# Altium project PCB_NRF24L01.PrjPcb
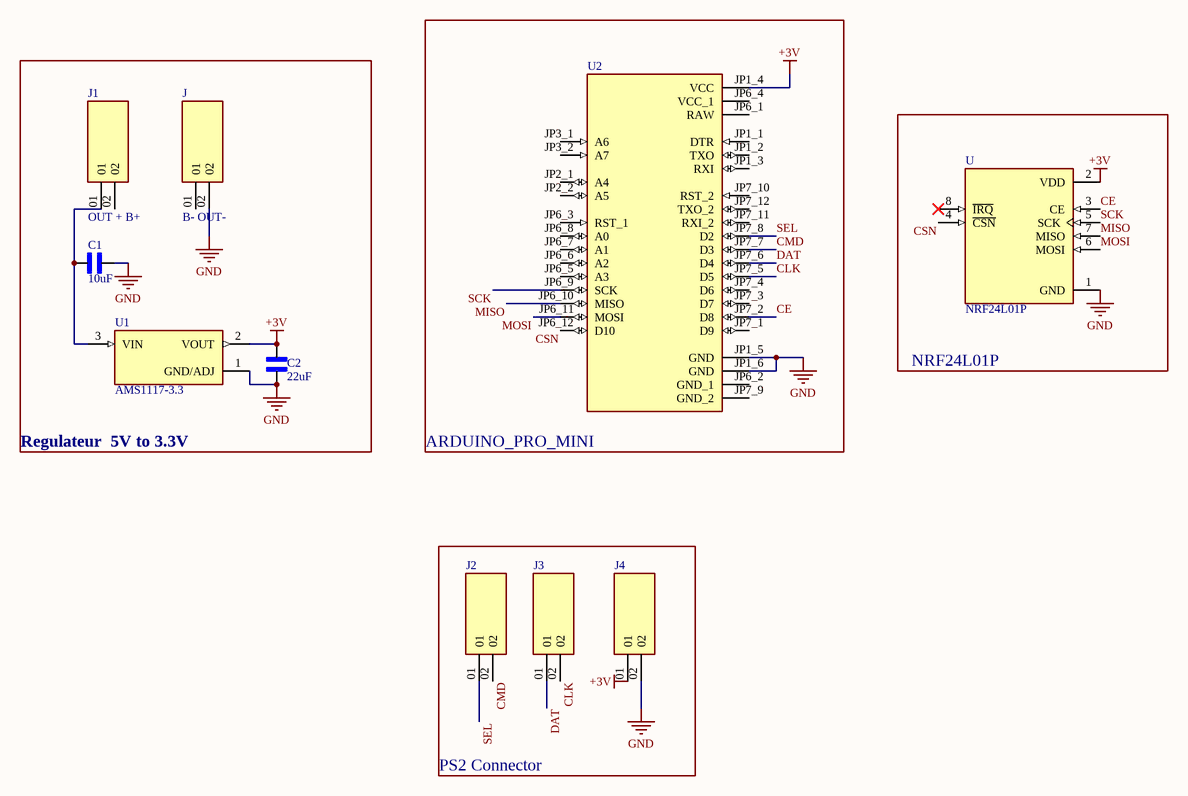
[diagram p0: NRF24L01.SchDoc]
1 sheet, 10 parts. Net scope: global (net labels, ports and power ports of the same name join across sheets).
Board file: NRF.PcbDoc

## Sheet NRF24L01.SchDoc
size A4; SheetNumber: 1; SheetTotal: 1

### Parts
C1  10uF  [CAPC1608X100N]
C2  22uF  [CAPC2012X145N]
J  B- OUT-  [SAMTEC_ZW-02-10-T-S-316-236]
J1  OUT + B+  [SAMTEC_ZW-02-10-T-S-316-236]
J2  SCL CMD  [SAMTEC_ZW-02-10-T-S-316-236]  (value not drawn)
J3  DAT CLK  [SAMTEC_ZW-02-10-T-S-316-236]  (value not drawn)
J4  3.3V GND  [SAMTEC_ZW-02-10-T-S-316-236]  (value not drawn)
U  NRF24L01P  [XCVR_NRF24L01P-MODULE-PCB]
U1  AMS1117-3.3  [SOT229P700X180-4N]
U2  ARDUINO_PRO_MINI  [MODULE_ARDUINO_PRO_MINI]

### Blocks framed on the sheet
Regulateur  5V to 3.3V: C1 C2 J J1 U1
NRF24L01P: U
PS2 Connector: J2-J4

### Nets
+3V: C2.2 J4.01 U.2(VDD) U1.2(VOUT) U2.JP1_4(VCC)
GND: C1.1 C2.1 J.02 J4.02 U.1(GND) U1.1(GND/ADJ) U2.JP1_5(GND) U2.JP1_6(GND)
CE: U.3(CE) U2.JP7_2(D8)
CLK: J3.02 U2.JP7_5(D5)
CMD: J2.02 U2.JP7_7(D3)
CSN: U.4(~{CSN}) U2.JP6_12(D10)
DAT: J3.01 U2.JP7_6(D4)
MISO: U.7(MISO) U2.JP6_10(MISO)
MOSI: U.6(MOSI) U2.JP6_11(MOSI)
SCK: U.5(SCK) U2.JP6_9(SCK)
SEL: J2.01 U2.JP7_8(D2)
NetC1_2: C1.2 J1.01 U1.3(VIN)

Not connected (* = marked no-connect by the designer): J 01; J1 02; U 8(~{IRQ})*; U2 JP1_1(DTR) JP1_2(TXO) JP1_3(RXI) JP2_1(A4) JP2_2(A5) JP3_1(A6) JP3_2(A7) JP6_1(RAW) JP6_2(GND_1) JP6_3(RST_1) JP6_4(VCC_1) JP6_5(A3) JP6_6(A2) JP6_7(A1) JP6_8(A0) JP7_1(D9) JP7_3(D7) JP7_4(D6) JP7_9(GND_2) JP7_10(RST_2) JP7_11(RXI_2) JP7_12(TXO_2)

### Library data of the parts
C1 = GRM188R61E106MA73J: SMD Capacitor X5R(EIA) with Capacitance: 10uF Tol. 20%. Rated Voltage: 25Vdc; MF: Murata; SnapEDA_Link: https://www.snapeda.com/parts/GRM188R61E106MA73J/Murata/view-part/?ref=snap; Package: 1608 Murata; Value: *; MP: GRM188R61E106MA73J; Check_prices: https://www.snapeda.com/parts/GRM188R61E106MA73J/Murata/view-part/?ref=eda
C2 = GRM21BR61A226ME44L: SMD capacitor X5R(EIA) with capacitance 22uF Tol.20%. Rated voltage 10Vdc 85C; MF: Murata Electronics; SnapEDA_Link: https://www.snapeda.com/parts/GRM21BR61A226ME44L/Murata+Electronics+North+America/view-part/?ref=snap; Package: 2012 Murata; Value: *; MP: GRM21BR61A226ME44L; Check_prices: https://www.snapeda.com/parts/GRM21BR61A226ME44L/Murata+Electronics+North+America/view-part/?ref=eda
J J1-J4 = ZW-02-10-T-S-316-236: Package: None; MP: ZW-02-10-T-S-316-236; Value: *; Price: None; Availability: Unavailable
U = NRF24L01P-MODULE-PCB: - Transceiver For Use With nRF24L01+; MF: Nordic Semiconductor; Package: None; MP: NRF24L01P-MODULE-PCB; Value: *; Availability: Bad; Price: None; SnapEDA_Link: https://www.snapeda.com/parts/NRF24L01P-MODULE-PCB/Nordic%20Semiconductor%20ASA/view-part/230534/?ref=snap; Mouser-Purchase-URL: https://snapeda.com/shop?store=Mouser&id=230534
U1 = AMS1117-3.3: Sot223/Pkg 1-Amp 3.3-Volt Low Drop Out Voltage Regulatator; MF: Advanced Monolithic Systems; SnapEDA_Link: https://www.snapeda.com/parts/AMS1117-3.3/Advanced+Monolithic+Systems/view-part/?ref=snap; Package: SOT-223 Seeed Technology; Value: *; MP: AMS1117-3.3; Check_prices: https://www.snapeda.com/parts/AMS1117-3.3/Advanced+Monolithic+Systems/view-part/?ref=eda
U2 = ARDUINO_PRO_MINI: This board was developed for applications and installations where space is premium and projects are made as permanent set ups. Small, available in 3.3 V and 5 V versions, powered by ATmega328P.; MP: Arduino Pro Mini; SnapEDA_Link: https://www.snapeda.com/parts/Arduino%20Pro%20Mini/Arduino/view-part/?ref=snap; Package: None; Value: *; MF: Arduino; Check_prices: https://www.snapeda.com/parts/Arduino%20Pro%20Mini/Arduino/view-part/?ref=eda